# EAGLE schematic 555 timer (EAGLE 9.5.0)
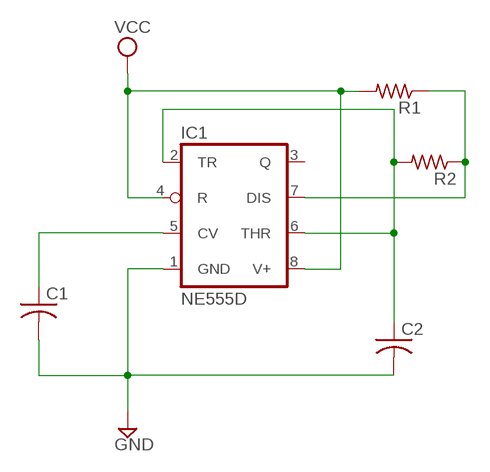
[diagram p0: schematic, sheet 1]

## Parts
C1  C-USC0805  [C0805]
C2  C-USC0805  [C0805]
IC1  NE555D  [SO08]
R1  R-US_R0805  [R0805]
R2  R-US_R0805  [R0805]

## Nets
GND: C1.2 C2.2 IC1.1(GND)
N$2: IC1.7(DIS) R1.1 R2.1
N$3: C1.1 IC1.5(CV)
N$4: C2.1 IC1.2(TR) IC1.6(THR) R2.2
VCC: IC1.4(R) IC1.8(V+) R1.2
Unconnected: IC1.3(Q)

## Library data of the parts
C1 C2 = rcl:C-US: CAPACITOR, American symbol; SPICEPREFIX: C
IC1 = linear:*555: TIMER
R1 R2 = rcl:R-US_: RESISTOR, American symbol; SPICEPREFIX: R